# EAGLE design PackTemperatureSensor - v.1.0 (EAGLE 9.5.2)
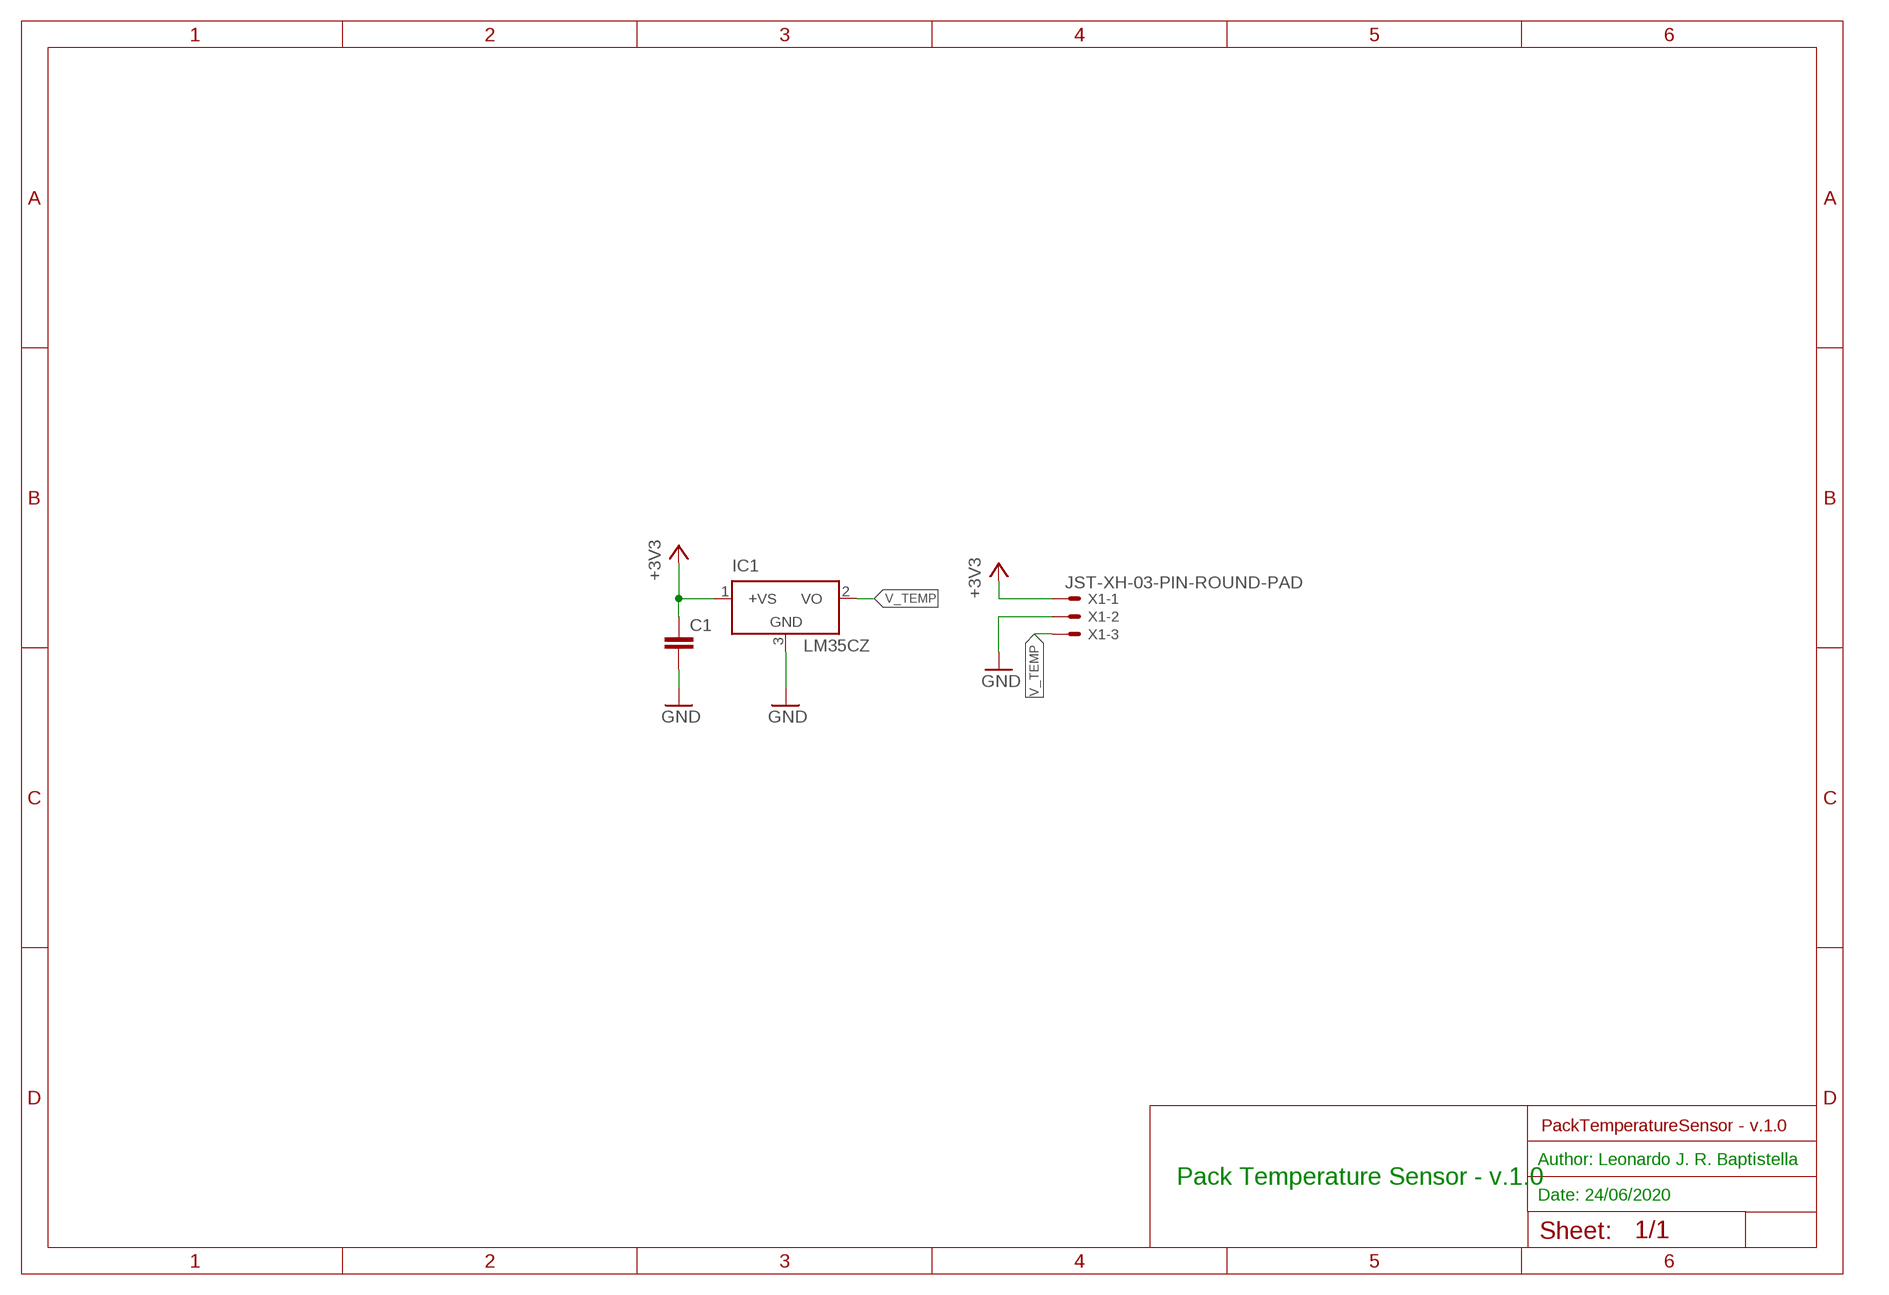
[diagram p0: schematic, sheet 1]

## Parts
C1  C-EUC1206  [C1206]
IC1  LM35CZ  [TO92]
X1  JST-XH-03-PIN-ROUND-PAD  [JST-XH-03-PACKAGE-ROUND-PAD]

## Nets
+3V3: C1.1 IC1.1(+VS) X1.1
GND: C1.2 IC1.3(GND) X1.2
V_TEMP: IC1.2(VO) X1.3

## Notes on the sheet
- Author: Leonardo J. R. Baptistella
- Pack Temperature Sensor - v.1.0
- Date: 24/06/2020

## Library data of the parts
C1 = rcl:C-EU: CAPACITOR, European symbol; SPICEPREFIX: C
IC1 = lm35:LM35: Single-Supply Centigrade Temperature Sensor Vout = (10mV/°C x Temp °C) +5mmmV Source: http://www.national.com/ds/LM/LM35.pdf
X1 = JST-XH-Zenith:JST-XH-03-PIN: JST XH Connector 2 Pin Wire to board connector. Pitch: 2,54 mm, (0.100") Number of pins: 3 Created by Rembrandt Electronics www.rembrandtelectronics.com

## Board
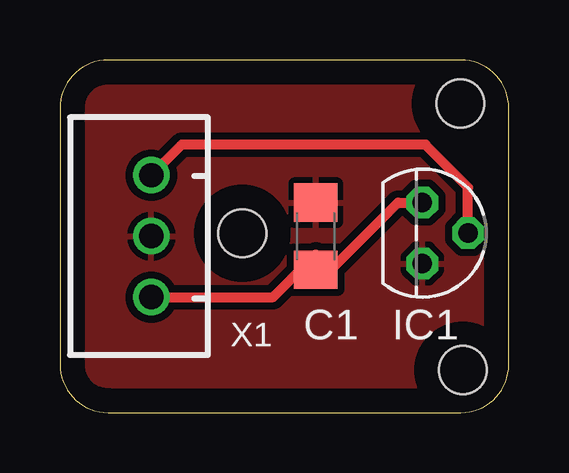
[diagram p1: board, top side]
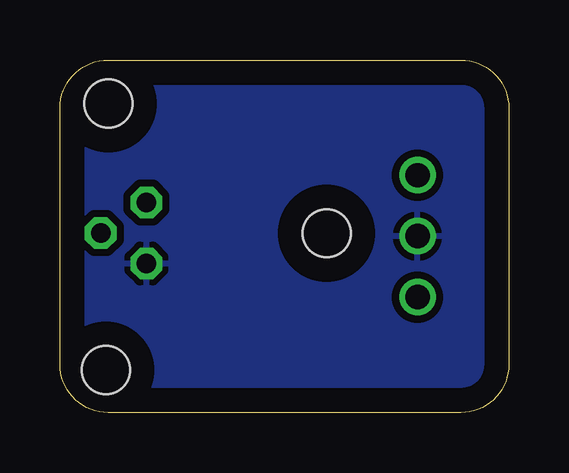
[diagram p2: board, bottom side, seen from below]

Size 18.72 x 14.69 mm. Coordinates in mm from the lower left corner, seen from the top.
Outline: 0,12.69 0,2 arc90 2,0 16.72,0 arc90 18.72,2 18.72,12.69 arc90 16.72,14.69 2,14.69 arc90 0,12.69
Copper layers (1*16): Top 0.035mm / dielectric 1.5mm / Bottom 0.035mm
Design rules "default": minimum track width 6mil, minimum drill 0.35mm, track to track 6mil, track to pad 6mil, pad to pad 6mil, via to via 6mil, smd to smd 6mil, copper to edge 40mil, drill to drill 6mil, minimum pad ring 10mil, minimum via ring 8mil, stop-mask expansion 4mil, vias tented up to drill 0mil, thermal gap 10mil
Holes 2 mm at 16.8,1.77 16.7,12.87 7.6,7.47

### Footprints (pad centres in the part's own frame; a part is rotated, then mirrored left to right if it is on the bottom)
C1206 = smd 1.6 x 1.8: 1 -1.4,0; 2 1.4,0
TO92 = drill 0.813 octagon: 1 -1.27,0; 2 0,1.905; 3 1.27,0
JST-XH-03-PACKAGE-ROUND-PAD = drill 1.016: 1 -2.54,0; 2 0,0; 3 2.54,0

### Placement (x,y rotation side)
C1  10.67,7.35 90 top
IC1  15.11,7.48 270 top
X1  3.81,7.35 90 top

### Tracks (layer width: path | path; a pad name or v marks a point on that pad's centre or on a via)
+3V3
  Top 0.406: X1.1 8.89,4.81 10.03,5.95 | 10.03,5.95 C1.1 | C1.1 10.67,6.59 10.03,5.95 | IC1.1 14.1,8.75 11.3,5.95 C1.1
GND
  pour Top (isolate 0.305): 2,14.87 17,14.87 arc-90 19,12.87 19,1.87 arc-90 17,-0.13 15,-0.13 2,-0.13 arc-90 0,1.87 0,12.87 arc-90
  pour Bottom (isolate 0.305): 17,14.87 arc-90 19,12.87 19,11.87 19,1.87 arc-90 17,-0.13 14,-0.13 2,-0.13 arc-90 0,1.87 0,2.87 0,12.87 arc-90 2,14.87 3,14.87
V_TEMP
  Top 0.406: IC1.2 17.02,9.38 15.24,11.16 5.08,11.16 X1.3